# Altium schematic sheet EMC_Stage.SchDoc
size A2
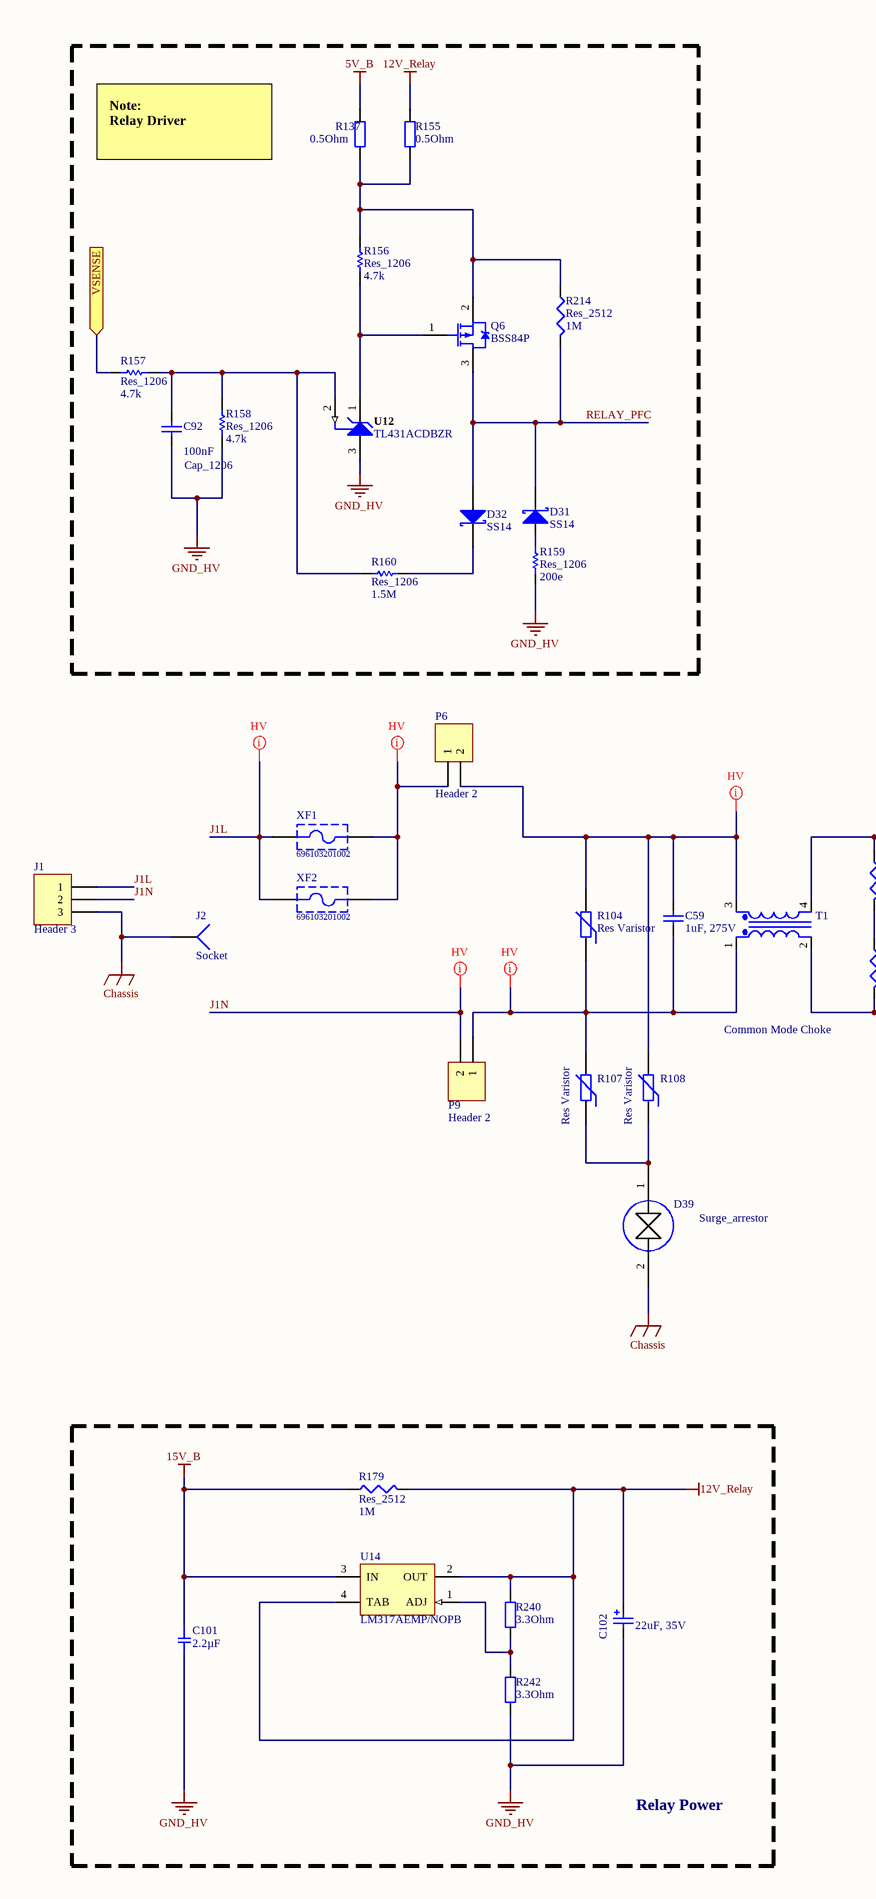
[diagram p0: EMC_Stage.SchDoc, left]
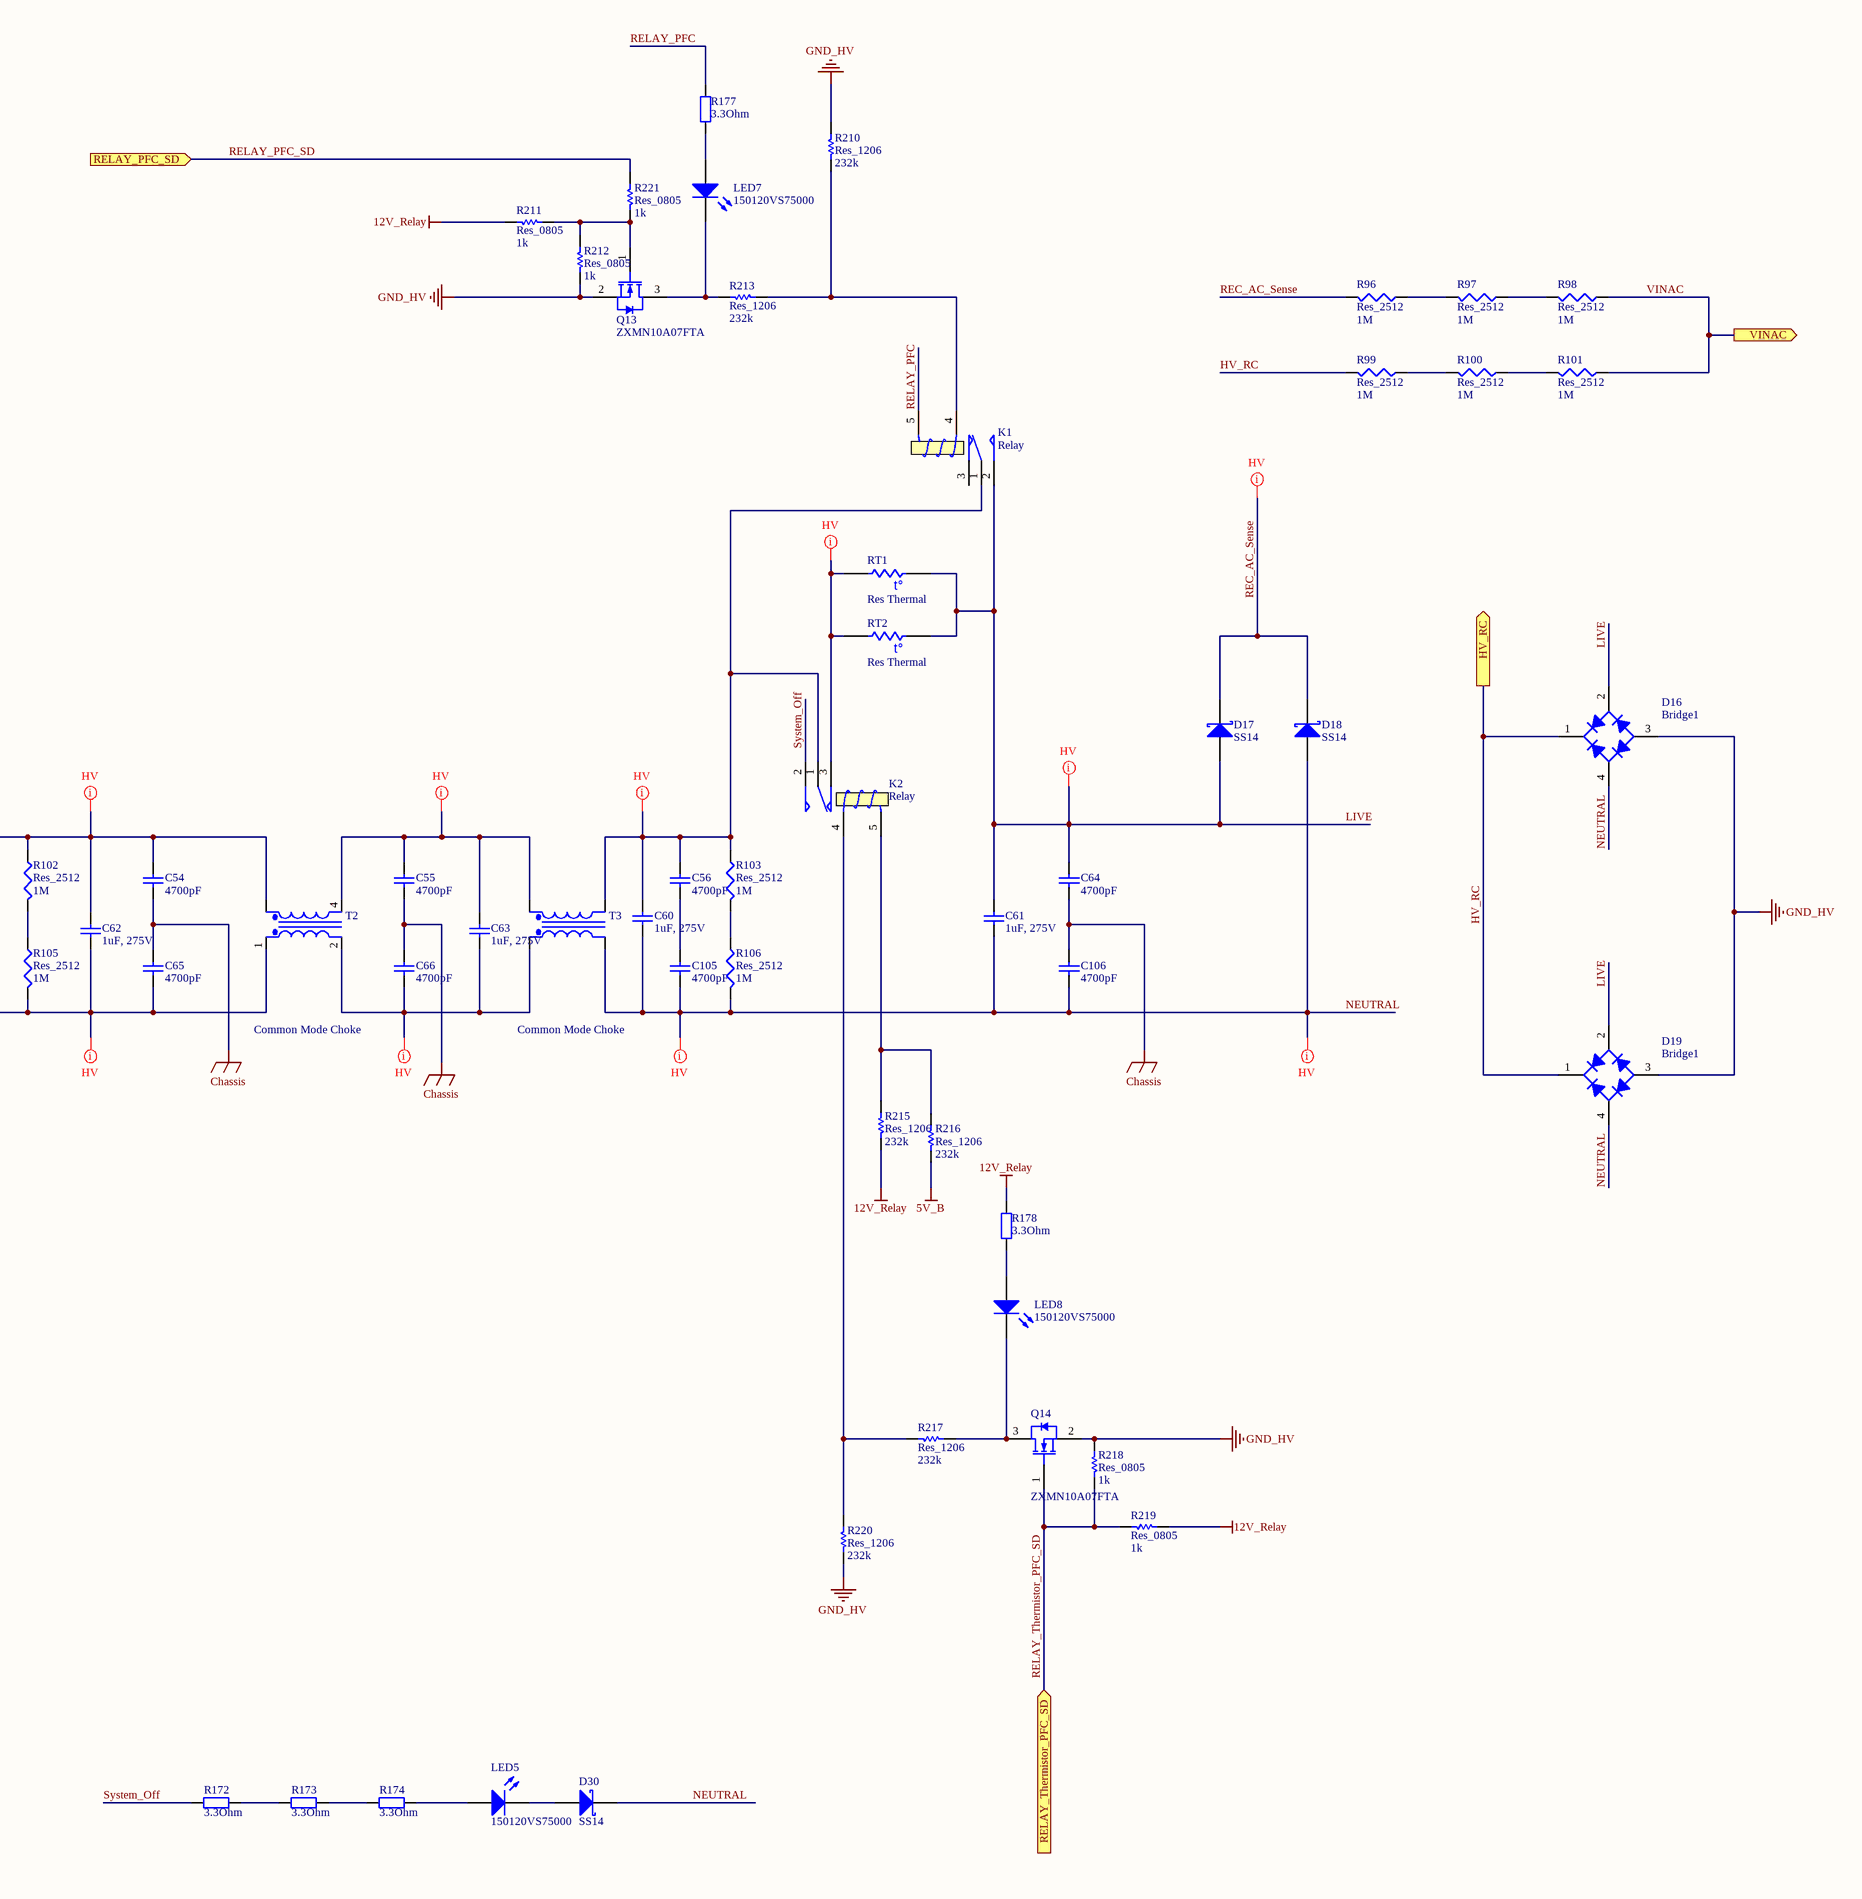
[diagram p1: EMC_Stage.SchDoc, right]

## Parts
C54  value 4700pF  [VY1472M61Y5UC63V0]  (hidden comment: VY1472M61Y5UC63V0)
C55  value 4700pF  [VY1472M61Y5UC63V0]  (hidden comment: VY1472M61Y5UC63V0)
C56  value 4700pF  [VY1472M61Y5UC63V0]  (hidden comment: VY1472M61Y5UC63V0)
C59  1uF, 275V  [L26_W11_H20_P22.5_CS]
C60  1uF, 275V  [L26_W11_H20_P22.5_CS]
C61  1uF, 275V  [L26_W11_H20_P22.5_CS]
C62  1uF, 275V  [L26_W11_H20_P22.5_CS]
C63  1uF, 275V  [L26_W11_H20_P22.5_CS]
C64  value 4700pF  [VY1472M61Y5UC63V0]  (hidden comment: VY1472M61Y5UC63V0)
C65  value 4700pF  [VY1472M61Y5UC63V0]  (hidden comment: VY1472M61Y5UC63V0)
C66  value 4700pF  [VY1472M61Y5UC63V0]  (hidden comment: VY1472M61Y5UC63V0)
C92  Cap_1206  value 100nF  [SMD-1206C]
C101  2.2µF  [SMD-1206C]
C102  22uF, 35V  [WCAP-ASLU_6.3x5.5]
C105  value 4700pF  [VY1472M61Y5UC63V0]  (hidden comment: VY1472M61Y5UC63V0)
C106  value 4700pF  [VY1472M61Y5UC63V0]  (hidden comment: VY1472M61Y5UC63V0)
D16  Bridge1  [PB4010]
D17  SS14  [DIOM4226X22N]
D18  SS14  [DIOM4226X22N]
D19  Bridge1  [PB4010]
D30  SS14  [DIOM4226X22N]
D31  SS14  [DIOM4226X22N]
D32  SS14  [DIOM4226X22N]
D39  Surge_arrestor  [A81-A600X]
J1  Header 3  [Barrier_Strip_3]
J2  Socket  [Spade_PCB_Terminal_Single]
K1  Relay  [Relay_T9GS5L14-5]
K2  Relay  [Relay_OMRON_5V]
LED5  150120VS75000  [1206_A]
LED7  150120VS75000  [1206_A]
LED8  150120VS75000  [1206_A]
P6  Header 2  [Spade_PCB_Terminal]
P9  Header 2  [Spade_PCB_Terminal]
Q6  BSS84P  [SOT95P278X110-3N]
Q13  ZXMN10A07FTA  [DIOD-SOT23-3_D_V]
Q14  ZXMN10A07FTA  [DIOD-SOT23-3_D_V]
R96  Res_2512  value 1M  [WRIS-KSKE_2512_H=0.6mm]
R97  Res_2512  value 1M  [WRIS-KSKE_2512_H=0.6mm]
R98  Res_2512  value 1M  [WRIS-KSKE_2512_H=0.6mm]
R99  Res_2512  value 1M  [WRIS-KSKE_2512_H=0.6mm]
R100  Res_2512  value 1M  [WRIS-KSKE_2512_H=0.6mm]
R101  Res_2512  value 1M  [WRIS-KSKE_2512_H=0.6mm]
R102  Res_2512  value 1M  [WRIS-KSKE_2512_H=0.6mm]
R103  Res_2512  value 1M  [WRIS-KSKE_2512_H=0.6mm]
R104  Res Varistor  [MOV-14D391K]
R105  Res_2512  value 1M  [WRIS-KSKE_2512_H=0.6mm]
R106  Res_2512  value 1M  [WRIS-KSKE_2512_H=0.6mm]
R107  Res Varistor  [MOV-14D391K]
R108  Res Varistor  [MOV-14D391K]
R137  0.5Ohm  [WRIS-KSKE_2512_H=0.6mm]
R155  0.5Ohm  [WRIS-KSKE_2512_H=0.6mm]
R156  Res_1206  value 4.7k  [WRIS-KSKE_1206_H=0.6mm]
R157  Res_1206  value 4.7k  [WRIS-KSKE_1206_H=0.6mm]
R158  Res_1206  value 4.7k  [WRIS-KSKE_1206_H=0.6mm]
R159  Res_1206  value 200e  [WRIS-KSKE_1206_H=0.6mm]
R160  Res_1206  value 1.5M  [WRIS-KSKE_1206_H=0.6mm]
R172  3.3Ohm  [WRIS-KSKE_1206_H=0.6mm]
R173  3.3Ohm  [WRIS-KSKE_1206_H=0.6mm]
R174  3.3Ohm  [WRIS-KSKE_1206_H=0.6mm]
R177  3.3Ohm  [WRIS-KSKE_1206_H=0.6mm]
R178  3.3Ohm  [WRIS-KSKE_1206_H=0.6mm]
R179  Res_2512  value 1M  [WRIS-KSKE_2512_H=0.6mm]
R210  Res_1206  value 232k  [WRIS-KSKE_1206_H=0.6mm]
R211  Res_0805  value 1k  [WRIS-KSKE_0805_H=0.6mm]
R212  Res_0805  value 1k  [WRIS-KSKE_0805_H=0.6mm]
R213  Res_1206  value 232k  [WRIS-KSKE_1206_H=0.6mm]
R214  Res_2512  value 1M  [WRIS-KSKE_2512_H=0.6mm]
R215  Res_1206  value 232k  [WRIS-KSKE_1206_H=0.6mm]
R216  Res_1206  value 232k  [WRIS-KSKE_1206_H=0.6mm]
R217  Res_1206  value 232k  [WRIS-KSKE_1206_H=0.6mm]
R218  Res_0805  value 1k  [WRIS-KSKE_0805_H=0.6mm]
R219  Res_0805  value 1k  [WRIS-KSKE_0805_H=0.6mm]
R220  Res_1206  value 232k  [WRIS-KSKE_1206_H=0.6mm]
R221  Res_0805  value 1k  [WRIS-KSKE_0805_H=0.6mm]
R240  3.3Ohm  [WRIS-KSKE_1206_H=0.6mm]
R242  3.3Ohm  [WRIS-KSKE_1206_H=0.6mm]
RT1  Res Thermal  [NTC-5D-7]
RT2  Res Thermal  [NTC-5D-7]
T1  Common Mode Choke  [Choke_40mm]
T2  Common Mode Choke  [Choke_40mm]
T3  Common Mode Choke  [Choke_40mm]
U12  TL431ACDBZR  [DBZ0003A_M]
U14  LM317AEMP/NOPB  [DCY0004A_L]
XF1  696103201002  [696103201002]
XF2  696103201002  [696103201002]

## Blocks framed on the sheet
Relay Power: C101 C102 R179 R240 R242 U14

## Ports
HV_RC (out), RELAY_PFC_SD (in), RELAY_Thermistor_PFC_SD (in), VINAC (out), VSENSE (in)

## Nets
5V_B: R137.2 R216.1
12V_Relay: C102.2(P) R155.2 R178.1 R179.2 R211.2 R215.1 R219.2 R240.2 U14.2(OUT) U14.4(TAB)
15V_B: C101.1 R179.1 U14.3(IN)
Chassis: C54.1 C55.1 C64.1 C65.2 C66.2 C106.2 D39.2 J1.3 J2.1
GND_HV: C92.1 C101.2 C102.1(N) D16.3(A) D19.3(A) Q13.2(S) Q14.2(S) R158.1 R159.1 R210.1 R212.1 R218.1 R220.1 R242.1 U12.3(ANODE)
HV_RC: D16.1(K) D19.1(K) R99.2 ; port HV_RC
J1L: J1.1 XF1.1 XF2.1
J1N: J1.2 P9.2
LIVE: C61.2 C64.2 D16.2(C) D17.2(A) D19.2(C) K1.2(COM) RT1.1 RT2.1
NEUTRAL: C60.1 C61.1 C105.1 C106.1 D16.4(C) D18.2(A) D19.4(C) D30.1(K) R106.2 T3.2(Pri-)
REC_AC_Sense: D17.1(K) D18.1(K) R96.2
RELAY_PFC: D31.1(K) D32.2(A) K1.5(T2) Q6.3(DRAIN) R177.1 R214.2
RELAY_PFC_SD: R221.1 ; port RELAY_PFC_SD
RELAY_Thermistor_PFC_SD: Q14.1(G) R218.2 R219.1 ; port RELAY_Thermistor_PFC_SD
System_Off: K2.2(COM) R172.1
VINAC: R98.1 R101.1 ; port VINAC
VSENSE: R157.2 ; port VSENSE
NetC54_2: C54.2 C62.2 R102.1 T1.4(Sec-) T2.3(Sec+)
NetC55_2: C55.2 C63.2 T2.4(Sec-) T3.3(Sec+)
NetC56_1: C56.1 C105.2
NetC56_2: C56.2 C60.2 K1.1(COM) K2.1(COM) R103.1 T3.4(Sec-)
NetC59_1: C59.1 P9.1 R104.1 R107.2 T1.1(Pri+)
NetC59_2: C59.2 P6.2 R104.2 R108.2 T1.3(Sec+)
NetC62_1: C62.1 C65.1 R105.2 T1.2(Pri-) T2.1(Pri+)
NetC63_1: C63.1 C66.1 T2.2(Pri-) T3.1(Pri+)
NetC92_2: C92.2 R157.1 R158.2 R160.2 U12.2(REF)
NetD30_2: D30.2(A) LED5.1(K)
NetD31_2: D31.2(A) R159.2
NetD32_1: D32.1(K) R160.1
NetD39_1: D39.1 R107.1 R108.1
NetK1_4: K1.4(T1) R210.2 R213.2
NetK2_3: K2.3(NO) RT1.2 RT2.2
NetK2_4: K2.4(T1) R217.1 R220.2
NetK2_5: K2.5(T2) R215.2 R216.2
NetLED5_2: LED5.2(A) R174.2
NetLED7_1: LED7.1(K) Q13.3(D) R213.1
NetLED7_2: LED7.2(A) R177.2
NetLED8_1: LED8.1(K) Q14.3(D) R217.2
NetLED8_2: LED8.2(A) R178.2
NetP6_1: P6.1 XF1.2 XF2.2
NetQ6_1: Q6.1(GATE) R156.1 U12.1(CATHODE)
NetQ6_2: Q6.2(SOURCE) R137.1 R155.1 R156.2 R214.1
NetQ13_1: Q13.1(G) R211.1 R212.2 R221.2
NetR96_1: R96.1 R97.2
NetR97_1: R97.1 R98.2
NetR99_1: R99.1 R100.2
NetR100_1: R100.1 R101.2
NetR102_2: R102.2 R105.1
NetR103_2: R103.2 R106.1
NetR172_2: R172.2 R173.1
NetR173_2: R173.2 R174.1
NetR240_1: R240.1 R242.2 U14.1(ADJ)

Not connected (* = marked no-connect by the designer): K1 3(NO)

## Layout directives
net class HV; rule Clearance Constraint [Generic clearance = 50mil, and 19 value(s) for objects]: J1L, J1N, LIVE, NetC54_2, NetC55_2, NetC56_2, NetC59_1, NetC59_2, NetC62_1, NetC63_1, NetK2_3, NetP6_1, NEUTRAL, REC_AC_Sense

## Notes on the sheet
- Note:
  Relay Driver
- (in symbol Res Thermal) t°

## Library data of the parts
C54-C56 C64-C66 C105 C106 = VY1472M61Y5UC63V0: Capacitor; Published: 8-Jun-2000; LatestRevisionDate: 17-Jul-2002; LatestRevisionNote: Re-released for DXP Platform.; PackageReference: RAD-0.3; Publisher: Altium Limited; PackageDescription: Radial Cap, Thru-Hole; 2 Leads; 0.3 in Pin Spacing
C59-C63 = 890324026027CS: WCAP-FTX2 THT Film Capacitors, 1uF, 275VAC; Insulation Resistance: 10000Ohm x F; Dissipation Factor@1kHz: 0.1%; Dissipation Factor@10kHz: 0.7%; Pitch: 22.5mm; Rate of Voltage Rise: 170V/us; Technical Reference: MX2P225105K275ACPP36004; ComponentLink1Description: Manufacturer; ComponentLink1URL: http://www.we-online.de; ComponentLink2Description: Datasheet; ComponentLink2URL: https://katalog.we-online.com/pbs/datasheet/890324026027CS.pdf; Length: 26mm; Mounting Technology: THT; Packaging: Bulk and Carton; Part Number: 890324026027CS; Operating Temperature: -40 to +105degC; Width: 11mm; Capacitance: 1uF; Dissipation Factor@100kHz: -; Height: 20mm; Rated Voltage: 275VAC; Publisher: Wurth Elektronik; Published Date: August 2019
C92 = Cap: Capacitor; Published: 8-Jun-2000; LatestRevisionDate: 17-Jul-2002; LatestRevisionNote: Re-released for DXP Platform.; PackageReference: RAD-0.3; Publisher: Altium Limited; PackageDescription: Radial Cap, Thru-Hole; 2 Leads; 0.3 in Pin Spacing
C101 = GCJ31CR71H225KA12L: CAP CER 2.2UF 50V X7R 1206; Manufacturer: Murata Electronics North America; Factory Stock: 0; Unit Price (USD): 0.4; Minimum Quantity: 1; Tolerance: ±10%; Datasheets: http://www.murata.com/~/media/webrenewal/support/library/catalog/products/capacitor/mlcc/c03e.ashx; Image: //media.digikey.com/Renders/Murata%20Renders/GR331BD72E473KW01L.jpg; Digi-Key Part Number: 490-5809-1-ND; Part Number: GCJ31CR71H225KA12L; Quantity Available: 120717; @ qty: 0; Packaging: Cut Tape (CT); Series: GCJ; Part Status: Active; Value: 2.2µF; Voltage: 50V; Temperature Coefficient: X7R; Operating Temperature: -55°C ~ 125°C; Features: Soft Termination; Ratings: AEC-Q200; Applications: Automotive, Boardflex Sensitive; Mounting Type: Surface Mount, MLCC; Package / Case: 1206 (3216 Metric); Size / Dimension: 0.126" L x 0.063" W (3.20mm x 1.60mm); Height - Seated (Max): -; Thickness (Max): 0.075" (1.90mm); Lead Spacing: -; Lead Style: -
C102 = 865090543005: WCAP-ASLU Aluminium Electrolytic Capacitors, D6.3mm x L5.5mm, 22uF, +/-20%, 35VDC; Dissipation Factor: 14%; Leakage Current: 1.54uA; Endurance: 1000h; Technical Reference: ASBD055220M035DVCTBA000; Ripple Current max.: 46mA; ComponentLink1Description: Manufacturer; ComponentLink1URL: http://www.we-online.de; ComponentLink2Description: Datasheet; ComponentLink2URL: https://katalog.we-online.com/pbs/datasheet/865090543005.pdf; Mounting Technology: SMD; Operating Temperature: -40 to +85degC; Packaging: Tape and Reel; Part Number: 865090543005; Publisher: Wurth Elektronik; Capacitance: 22uF; Diameter: 6.3mm; Length: 5.5mm; Published Date: August 2019; Rated Voltage: 35VDC; Capacitance Tolerance: +/-20%
D16 D19 = Bridge1: Full Wave Diode Bridge; Published: 8-Jun-2000; LatestRevisionDate: 29-May-2009; LatestRevisionNote: Sch pins A & K swapped.; DatasheetVersion: E2732B; PackageReference: D-38; Publisher: Altium Limited; PackageDescription: Bridge Rectifier; 4 Terminals; Body 9.4 x 9.4 mm (typ); Pitch 5.08 mm
D17 D18 D30-D32 = SS14: Schottky Rectifier, 1.1 W, -65 to 125 degC, 2-Pin SMD, RoHS, Tape and Reel; Manufacturer: Fairchild; Configuration: SINGLE; Diode Element Material: SILICON; Power Dissipation Limit-Max (W): 1.1; Additional Feature: FREEWHEELINGDIODE; Signal Diode Type: SIGNALDIODE; Number of Elements: 1; JEDEC-95 Code: DO-214AC; Rep Pk Reverse Voltage-Max (V): 40; Package Body Material: PLASTIC/EPOXY; CAGE Code: 1HBD3,07933,59621,7D893; Peak Reflow Temperature (Cel): 260; Package Shape: RECTANGULAR; Manufacturer URL: https://www.fairchildsemi.com/; JESD-97 Code: e3; Package Reference: DO-214AC-2; RoHS Compliant: YES; Package Description: 2-Pin Surface Mount Device, Body 4.375 x 2.725 mm; Technology: SCHOTTKY; Surface Mount: YES; Datasheet URL: http://www.onlinecomponents.com/datasheet/ss14.aspx?p=11369800; Terminal Form: CBEND; Package Style: SMALLOUTLINE; Number of Terminals: 2; JESD-30 Code: R-PDSO-C2; Average Forward Current-Max (A): 1; Terminal Finish: MATTETIN; Datasheet Version: Oct-13; Terminal Position: DUAL; Package URL: https://www.fairchildsemi.com/package-drawings/DO/DO214AC.pdf; Moisture Sensitivity Level: 1; Lead Free: YES
J1 = Header 3: Header, 3-Pin; LatestRevisionDate: 17-Jul-2002; LatestRevisionNote: Re-released for DXP Platform.; Publisher: Altium Limited
J2 = Socket: Earth; LatestRevisionDate: 17-Jul-2002; LatestRevisionNote: Re-released for DXP Platform.; Publisher: Altium Limited
K1 K2 = Relay: SPDT Relay; Published: 8-Jun-2000; LatestRevisionDate: 17-Jul-2002; LatestRevisionNote: Re-released for DXP Platform.; PackageReference: MODULE5B; Publisher: Altium Limited
LED5 LED7 LED8 = 150120VS75000: SMD mono-color Chip LED, WL-SMCW, Bright Green; PackageReference: 1206_A; Color: Bright Green; PartNumber: 150120VS75000; ComponentLink1Description: Manufacturer URL; ComponentLink1URL: http://www.we-online.com; ComponentLink2Description: Datasheet; ComponentLink2URL: http://katalog.we-online.com/led/datasheet/150120VS75000.pdf
P6 P9 = Header 2: Header, 2-Pin; LatestRevisionDate: 17-Jul-2002; LatestRevisionNote: Re-released for DXP Platform.; Publisher: Altium Limited
Q6 = CMP-1099-00028-1: P-Channel SIPMOS Small-Signal-Transistor, -60 V VDS, -0.17 A ID, -55 to 150 degC, PG-SOT23, Reel, Green; Manufacturer: Infineon; VGS(th) (max): -2Â V; VGS(th) (min): -1Â V; VDS (max): -60Â V; Rth: 350Â K/W; Pto t (max): 0.36Â W; ID (max): -0.17Â A; IDpuls (max): -0.68Â A; RDS (on) (max) (@4.5V): 12,000Â mOhm; QG: 1Â nC; Green: TRUE; RDS (on) (max): 8,000Â mOhm; ComponentLink3URL: http://www.infineon.com/dgdl/SOT23-Package_Overview.pdf?folderId=db3a30431936bc4b0119532290053c66&fileId=db3a30431936bc4b0119533468123c85; ComponentLink3Description: Package Specification; Packing: Reel; PartNumber: BSS84P; ComponentLink2Description: Datasheet; Mounting Technology: Surface Mount; ComponentLink2URL: http://www.infineon.com/dgdl/BSS84P_Rev2.7%5B1%5D.pdf?folderId=db3a304314dca38901154a72e3951a65&fileId=db3a304330f68606013118ac7a9b4549; PackageReference: PG-SOT23; ComponentLink1URL: http://www.infineon.com/; PackageVersion: Apr-08; ComponentLink1Description: Manufacturer URL; PackageDescription: 3-Pin Small Outline Transistor Package, 2.9 x 1.3 mm Body, 0.95 mm Pitch; Halogen-free: TRUE; DatasheetVersion: Rev. 2.7
Q13 Q14 = CMP-2000-07433-1: N-Channel Enhancement Mode MOSFET, 100 V, -55 to 150 degC, 3-Pin SOT23, RoHS, Tape and Reel; Manufacturer: Diodes Inc; Drain-to-Source Voltage [Vdss]: 100V; Qg Gate Charge: 2.9nC; Rated Power Dissipation: 625mW; Drain-Source On Resistance-Max: 0.7O; Package Description: 3-Pin Small Outline Transistor, Body 2.9 x 1.3 mm, Pitch 0.96 mm; Channel Type: N-Channel; Mounting Technology: SurfaceMount; Datasheet Version: Rev. 6-2, 08/2012; Manufacturer URL: http://www.diodes.com/; Datasheet URL: http://www.diodes.com/_files/datasheets/ZXMN10A07F.pdf; Package Reference: SOT23-3
R96-R103 R105 R106 R179 R214 = Res3: Resistor; Published: 8-Jun-2000; LatestRevisionDate: 29-May-2009; LatestRevisionNote: IPC-7351 Footprint Added.; PackageReference: J1-0603; Publisher: Altium Limited; PackageDescription: Chip Resistor
R104 R107 R108 = Res Varistor: Varistor (Voltage-Sensitive Resistor); Published: 24-Mar-1999; LatestRevisionDate: 29-May-2009; LatestRevisionNote: IPC-7351 Footprint Added.; PackageVersion: Mar-2003; PackageReference: 6-0805; Publisher: Altium Limited; PackageDescription: Chip Resistor 0805 Case Size; Code_IPC: RESC2012
R137 R155 = 560050363011: WRIS-KSKE Thick Film Resistors, size 2512, 0.5Ohm, +/-1%, 1W; Rated Current: 1.41A; Temperature Coefficient of Resistance: +/-100ppm/degC; Technical Reference: KE2512R500F101KAATE0000; ComponentLink1Description: Manufacturer; ComponentLink1URL: http://www.we-online.de; ComponentLink2Description: Datasheet; ComponentLink2URL: https://katalog.we-online.com/pbs/datasheet/560050363011.pdf; Publisher: Wurth Elektronik; Rated Power: 1W; Resistance: 0.5Ohm; Mounting Technology: SMT; Height: 0.6mm; Part Number: 560050363011; Packaging: Tape and Reel; Published Date: September 2019; Size: 2512; Length: 6.3mm; Operating Temperature: -55 to +155degC; Resistance Tolerance: +/-1%; Width: 3.2mm
R156-R160 R210-R213 R215-R221 = Res1: Resistor; Published: 8-Jun-2000; LatestRevisionDate: 17-Jul-2002; LatestRevisionNote: Re-released for DXP Platform.; PackageReference: AXIAL-0.3; Publisher: Altium Limited; PackageDescription: Axial Device, Thru-Hole; 2 Leads; 0.3 in Pin Spacing
R172-R174 R177 R178 R240 R242 = 560050332011: WRIS-KSKE Thick Film Resistors, size 1206, 3.3Ohm, +/-1%, 0.5W; Rated Current: 0.38A; Temperature Coefficient of Resistance: +/-100ppm/degC; Technical Reference: KE12063R30F102KAATP0000; ComponentLink1Description: Manufacturer; ComponentLink1URL: http://www.we-online.de; ComponentLink2Description: Datasheet; ComponentLink2URL: https://katalog.we-online.com/pbs/datasheet/560050332011.pdf; Publisher: Wurth Elektronik; Rated Power: 0.5W; Resistance: 3.3Ohm; Mounting Technology: SMT; Height: 0.6mm; Part Number: 560050332011; Packaging: Tape and Reel; Published Date: September 2019; Size: 1206; Length: 3.1mm; Operating Temperature: -55 to +155degC; Resistance Tolerance: +/-1%; Width: 1.6mm
RT1 RT2 = Res Thermal: Thermistor; Published: 24-Mar-1999; LatestRevisionDate: 29-May-2009; LatestRevisionNote: IPC-7351 Footprint Added.; PackageVersion: Mar-2003; PackageReference: 6-0805; Publisher: Altium Limited; PackageDescription: Chip Resistor 0805 Case Size; Code_IPC: RESC2012
T1-T3 = Trans Eq: Transformer (Equivalent Circuit Model); Published: 8-Jun-2000; LatestRevisionDate: 17-Jul-2002; LatestRevisionNote: Re-released for DXP Platform.; PackageReference: TRF_4; Publisher: Altium Limited; PackageDescription: Transformer; 4 Leads
U12 = CMP-0366-01028-2: Adjustable Precision Shunt Regulator, 34 ppm / degC, 100 mA, 0 to 70 degC, 3-pin SOT-23 (DBZ), Green (RoHS & no Sb/Br); Manufacturer: Texas Instruments; Min Iz for Regulation(uA): 600; Rating: Catalog; Initial Accuracy @ 25/deg C(%): 1; VO Adj(Min)(V): 2.495; Temp Coeff(Typ)(ppm/ degree C): 34; VO Adj(Max)(V): 36; Iout/Iz(Max)(mA): 100; SubFamily: Shunt Voltage Reference; PartNumber: TL431ACDBZR; PackageReference: DBZ0003A; ComponentLink1URL: http://www.ti.com/; Mounting Technology: Surface Mount; ComponentLink2Description: Datasheet; ComponentLink3URL: http://www.ti.com/litv/pdf/mpds108a; ComponentLink2URL: http://www.ti.com/general/docs/lit/getliterature.tsp?genericPartNumber=TL431A&fileType=pdf; PackageVersion: 4203227/B; Code_JEDEC: TO-236; PackageDescription: 3-Pin Plastic Small Outline, Body 2.92 x 1.3 mm, Pitch 0.95 mm; DatasheetVersion: SLVS543M; Eco-Plan: Green (RoHS & no Sb/Br); ComponentLink1Description: Manufacturer URL; ComponentLink3Description: Package Specification
U14 = CMP-0062-01710-3: 3-Terminal Adjustable Regulator, 4-pin SOT-223, Pb-Free; Manufacturer: Texas Instruments; PowerWise: N; CompType: LDO IC; PackageTopMarking: XYTT*N07A; PackageDescription: Molded SOT-223, 6.50 x 3.56 x 1.6mm Body, 4 Lead, 2.3mm Pitch; Code_JEDEC: TO-261-AA; RoHS: Y; ComponentLink1URL: http://www.ti.com/general/docs/lit/getliterature.tsp?genericPartNumber=LM317-N&fileType=pdf; PackageReference: DCY0004A; ComponentLink1Description: Datasheet URL; Code_IPC: SOT223-4; PinCount: 4
XF1 XF2 = CMP-1502-00239-1: WR-FSH Fuse Holder Blocks Fuse Holder Blocks Clip Cover for PCB - THR Version; Manufacturer: Wurth Elektronik; Fuse Size: 5x20mm; Package Reference: 696103201002; Operating Temperature: -30to120degC; Part Number: 696103201002; Packaging: Box; Datasheet URL: https://katalog.we-online.de/em/datasheet/696103201002.pdf; Publisher: WurthElektronik; Mounting Technology: THR; Manufacturer URL: http://www.we-online.de